# EAGLE design P1001-001-007-320 - Programmer (EAGLE 9.4.2)

## Sheet 1 of 2
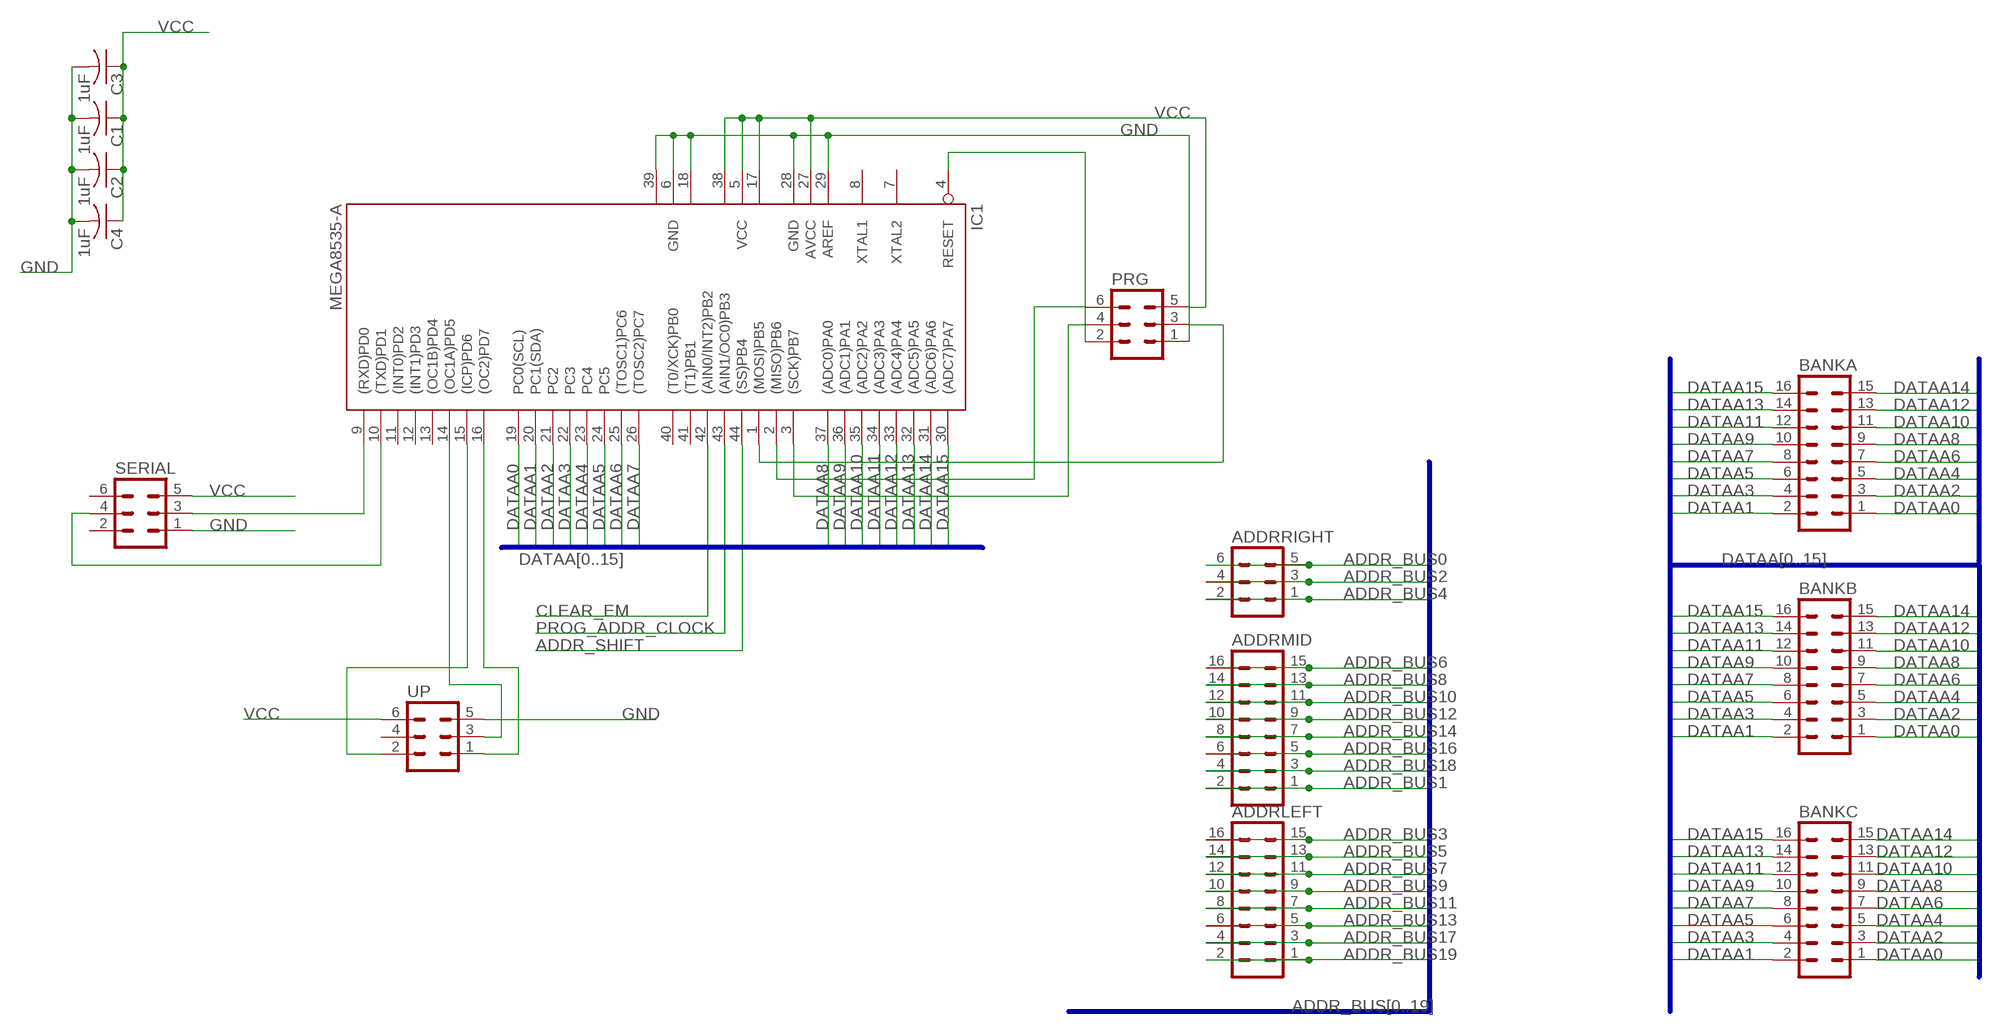
[diagram p0: schematic, sheet 1]

### Parts
ADDRLEFT  ML16  [ML16]
ADDRMID  ML16  [ML16]
ADDRRIGHT  ML6  [ML6]
BANKA  ML16  [ML16]
BANKB  ML16  [ML16]
BANKC  ML16  [ML16]
C1  1uF  C-USC1206  [C1206]
C2  1uF  C-USC1206  [C1206]
C3  1uF  C-USC1206  [C1206]
C4  1uF  C-USC1206  [C1206]
IC1  MEGA8535-A  [TQFP44]
PRG  ML6  [ML6]
SERIAL  ML6  [ML6]
UP  ML6  [ML6]

### Nets
ADDR_BUS0: ADDRRIGHT.5 ADDRRIGHT.6 ; also sheet 2
ADDR_BUS1: ADDRMID.1 ADDRMID.2 ; also sheet 2
ADDR_BUS2: ADDRRIGHT.3 ADDRRIGHT.4 ; also sheet 2
ADDR_BUS3: ADDRLEFT.15 ADDRLEFT.16 ; also sheet 2
ADDR_BUS4: ADDRRIGHT.1 ADDRRIGHT.2 ; also sheet 2
ADDR_BUS5: ADDRLEFT.13 ADDRLEFT.14 ; also sheet 2
ADDR_BUS6: ADDRMID.15 ADDRMID.16 ; also sheet 2
ADDR_BUS7: ADDRLEFT.11 ADDRLEFT.12 ; also sheet 2
ADDR_BUS8: ADDRMID.13 ADDRMID.14 ; also sheet 2
ADDR_BUS9: ADDRLEFT.9 ADDRLEFT.10 ; also sheet 2
ADDR_BUS10: ADDRMID.11 ADDRMID.12 ; also sheet 2
ADDR_BUS11: ADDRLEFT.7 ADDRLEFT.8 ; also sheet 2
ADDR_BUS12: ADDRMID.9 ADDRMID.10 ; also sheet 2
ADDR_BUS13: ADDRLEFT.5 ADDRLEFT.6 ; also sheet 2
ADDR_BUS14: ADDRMID.7 ADDRMID.8 ; also sheet 2
ADDR_BUS16: ADDRMID.5 ADDRMID.6 ; also sheet 2
ADDR_BUS17: ADDRLEFT.3 ADDRLEFT.4 ; also sheet 2
ADDR_BUS18: ADDRMID.3 ADDRMID.4 ; also sheet 2
ADDR_BUS19: ADDRLEFT.1 ADDRLEFT.2 ; also sheet 2
ADDR_SHIFT: IC1.44((SS)PB4) ; also sheet 2
CLEAR_EM: IC1.42((AIN0/INT2)PB2) ; also sheet 2
DATAA0: BANKA.1 BANKB.1 BANKC.1 IC1.19(PC0(SCL))
DATAA1: BANKA.2 BANKB.2 BANKC.2 IC1.20(PC1(SDA))
DATAA2: BANKA.3 BANKB.3 BANKC.3 IC1.21(PC2)
DATAA3: BANKA.4 BANKB.4 BANKC.4 IC1.22(PC3)
DATAA4: BANKA.5 BANKB.5 BANKC.5 IC1.23(PC4)
DATAA5: BANKA.6 BANKB.6 BANKC.6 IC1.24(PC5)
DATAA6: BANKA.7 BANKB.7 BANKC.7 IC1.25((TOSC1)PC6)
DATAA7: BANKA.8 BANKB.8 BANKC.8 IC1.26((TOSC2)PC7)
DATAA8: BANKA.9 BANKB.9 BANKC.9 IC1.37((ADC0)PA0)
DATAA9: BANKA.10 BANKB.10 BANKC.10 IC1.36((ADC1)PA1)
DATAA10: BANKA.11 BANKB.11 BANKC.11 IC1.35((ADC2)PA2)
DATAA11: BANKA.12 BANKB.12 BANKC.12 IC1.34((ADC3)PA3)
DATAA12: BANKA.13 BANKB.13 BANKC.13 IC1.33((ADC4)PA4)
DATAA13: BANKA.14 BANKB.14 BANKC.14 IC1.32((ADC5)PA5)
DATAA14: BANKA.15 BANKB.15 BANKC.15 IC1.31((ADC6)PA6)
DATAA15: BANKA.16 BANKB.16 BANKC.16 IC1.30((ADC7)PA7)
GND [power]: C1.2 C2.2 C3.2 C4.2 IC1.6(GND) IC1.18(GND1) IC1.28(GND) IC1.29(AREF) IC1.39(GND2) PRG.1 SERIAL.1 UP.5
N$1: IC1.14((OC1A)PD5) UP.3
N$2: IC1.1((MOSI)PB5) PRG.3
N$3: IC1.3((SCK)PB7) PRG.4
N$4: IC1.2((MISO)PB6) PRG.6
N$5: IC1.4(RESET) PRG.2
N$6: IC1.16((OC2)PD7) UP.1
N$7: IC1.9((RXD)PD0) SERIAL.3
N$8: IC1.10((TXD)PD1) SERIAL.4
N$9: IC1.15((ICP)PD6) UP.2
PROG_ADDR_CLOCK: IC1.43((AIN1/OC0)PB3) ; also sheet 2
VCC [power]: C1.1 C2.1 C3.1 C4.1 IC1.5(VCC) IC1.17(VCC1) IC1.27(AVCC) IC1.38(VCC2) PRG.5 SERIAL.5 UP.6 ; also sheet 2
Unconnected: IC1.7(XTAL2) IC1.8(XTAL1) IC1.11((INT0)PD2) IC1.12((INT1)PD3) IC1.13((OC1B)PD4) IC1.40((T0/XCK)PB0) IC1.41((T1)PB1) SERIAL.2 SERIAL.6 UP.4

### Buses
ADDR_BUS[0..19]
DATAA[0..15]

## Sheet 2 of 2
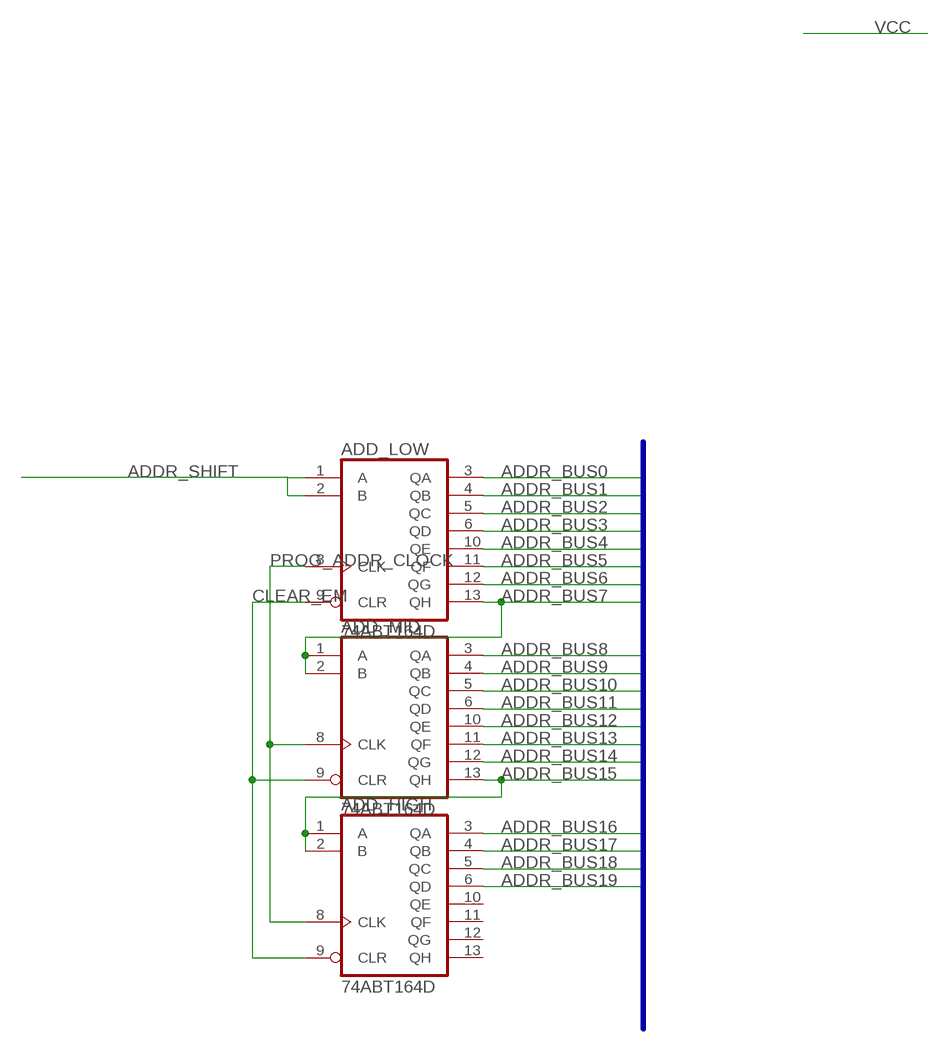
[diagram p1: schematic, sheet 2]

### Parts
ADD_HIGH  74ABT164D  [SO14]
ADD_LOW  74ABT164D  [SO14]
ADD_MID  74ABT164D  [SO14]

### Nets
ADDR_BUS0: ADD_LOW.3(QA) ; also sheet 1
ADDR_BUS1: ADD_LOW.4(QB) ; also sheet 1
ADDR_BUS2: ADD_LOW.5(QC) ; also sheet 1
ADDR_BUS3: ADD_LOW.6(QD) ; also sheet 1
ADDR_BUS4: ADD_LOW.10(QE) ; also sheet 1
ADDR_BUS5: ADD_LOW.11(QF) ; also sheet 1
ADDR_BUS6: ADD_LOW.12(QG) ; also sheet 1
ADDR_BUS7: ADD_LOW.13(QH) ADD_MID.1(A) ADD_MID.2(B) ; also sheet 1
ADDR_BUS8: ADD_MID.3(QA) ; also sheet 1
ADDR_BUS9: ADD_MID.4(QB) ; also sheet 1
ADDR_BUS10: ADD_MID.5(QC) ; also sheet 1
ADDR_BUS11: ADD_MID.6(QD) ; also sheet 1
ADDR_BUS12: ADD_MID.10(QE) ; also sheet 1
ADDR_BUS13: ADD_MID.11(QF) ; also sheet 1
ADDR_BUS14: ADD_MID.12(QG) ; also sheet 1
ADDR_BUS15: ADD_HIGH.1(A) ADD_HIGH.2(B) ADD_MID.13(QH)
ADDR_BUS16: ADD_HIGH.3(QA) ; also sheet 1
ADDR_BUS17: ADD_HIGH.4(QB) ; also sheet 1
ADDR_BUS18: ADD_HIGH.5(QC) ; also sheet 1
ADDR_BUS19: ADD_HIGH.6(QD) ; also sheet 1
ADDR_SHIFT: ADD_LOW.1(A) ADD_LOW.2(B) ; also sheet 1
CLEAR_EM: ADD_HIGH.9(CLR) ADD_LOW.9(CLR) ADD_MID.9(CLR) ; also sheet 1
PROG_ADDR_CLOCK: ADD_HIGH.8(CLK) ADD_LOW.8(CLK) ADD_MID.8(CLK) ; also sheet 1
Unconnected: ADD_HIGH.10(QE) ADD_HIGH.11(QF) ADD_HIGH.12(QG) ADD_HIGH.13(QH)

### Buses
ADDR_BUS[0..19]

## Power pins joined to a net without a drawn wire
GND: ADD_HIGH.7(GND) ADD_LOW.7(GND) ADD_MID.7(GND)
VCC: ADD_HIGH.14(VCC) ADD_LOW.14(VCC) ADD_MID.14(VCC)

## Library data of the parts
ADD_HIGH ADD_LOW ADD_MID = 74xx-us:74*164: 8-bit parallel out SHIFT REGISTER
ADDRLEFT ADDRMID BANKA BANKB BANKC = con-harting-ml:ML16: HARTING; OC_FARNELL: unknown; OC_NEWARK: unknown
ADDRRIGHT PRG SERIAL UP = con-harting-ml:ML6: HARTING; OC_FARNELL: unknown; OC_NEWARK: unknown
C1-C4 = rcl:C-US: CAPACITOR, American symbol; SPICEPREFIX: C
IC1 = atmel:MEGA8535: MICROCONTROLLER 8 Kbytes FLASH 512 bytes SRAM 512 bytes EEPROM USART 8-channel 10 bit ADC Source: avr.lbr; MPN: ATMEGA8535-16AU; OC_FARNELL: 1528437; OC_NEWARK: 01M6908

## Net classes
1 power: width 0.457 mm

## Board
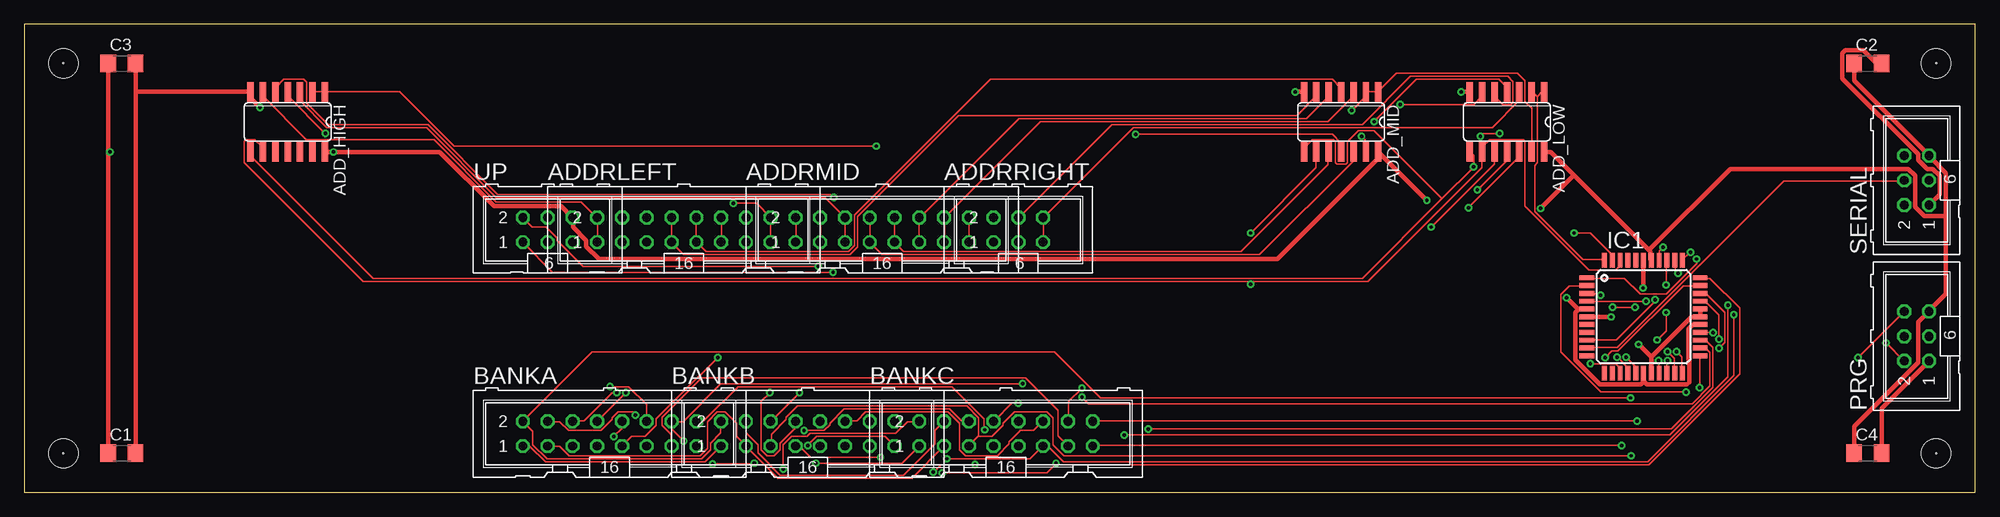
[diagram p2: board, top side]
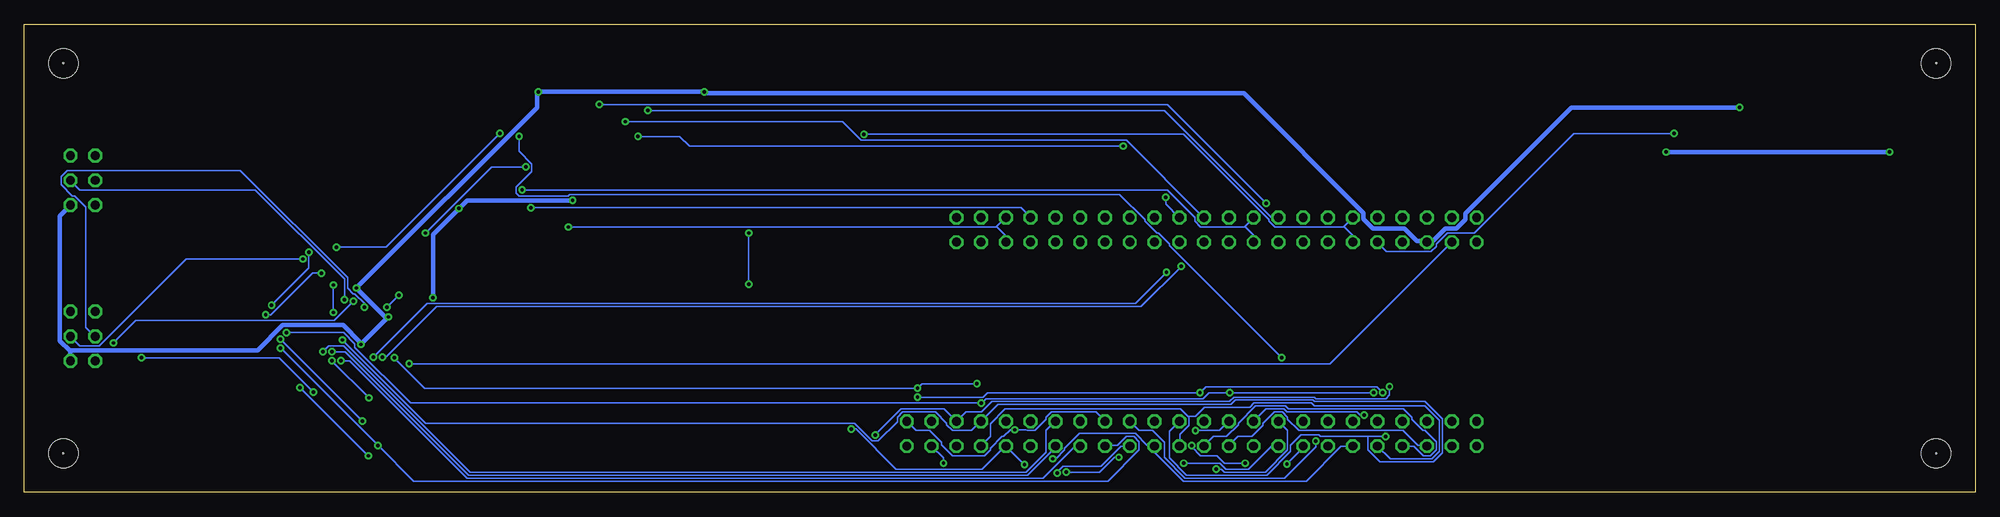
[diagram p3: board, bottom side, seen from below]

Size 200 x 48 mm. Coordinates in mm from the lower left corner, seen from the top.
Outline: 0,0 200,0 200,48 0,48 0,0
Copper layers (1*16): Top 0.035mm / dielectric 1.5mm / Bottom 0.035mm
Design rules "default *": minimum track width 6mil, minimum drill 0.35mm, track to track 6mil, track to pad 6mil, pad to pad 6mil, via to via 6mil, smd to smd 6mil, copper to edge 40mil, drill to drill 6mil, minimum pad ring 10mil, minimum via ring 8mil, stop-mask expansion 4mil, vias tented up to drill 0mil, thermal gap 10mil
Holes 0.12 mm at 4,4 196,44 4,44 196,4
Holes 3 mm at 4,44 4,4 196,4 196,44

### Footprints (pad centres in the part's own frame; a part is rotated, then mirrored left to right if it is on the bottom)
SO14 = smd 0.66 x 2.032: 1 -3.81,-3.073; 2 -2.54,-3.073; 3 -1.27,-3.073; 4 0,-3.073; 5 1.27,-3.073; 6 2.54,-3.073; 7 3.81,-3.073; 8 3.81,3.073; 9 2.54,3.073; 10 1.27,3.073; 11 0,3.073; 12 -1.27,3.073; 13 -2.54,3.073; 14 -3.81,3.073
ML16 = drill 0.914 octagon: 1 -8.89,-1.27; 2 -8.89,1.27; 3 -6.35,-1.27; 4 -6.35,1.27; 5 -3.81,-1.27; 6 -3.81,1.27; 7 -1.27,-1.27; 8 -1.27,1.27; 9 1.27,-1.27; 10 1.27,1.27; 11 3.81,-1.27; 12 3.81,1.27; 13 6.35,-1.27; 14 6.35,1.27; 15 8.89,-1.27; 16 8.89,1.27
ML6 = drill 0.914 octagon: 1 -2.54,-1.27; 2 -2.54,1.27; 3 0,-1.27; 4 0,1.27; 5 2.54,-1.27; 6 2.54,1.27
C1206 = smd 1.6 x 1.8: 1 -1.4,0; 2 1.4,0
TQFP44 = smd 1.5 x 0.5: 1 -5.8,4; 2 -5.8,3.2; 3 -5.8,2.4; 4 -5.8,1.6; 5 -5.8,0.8; 6 -5.8,0; 7 -5.8,-0.8; 8 -5.8,-1.6; 9 -5.8,-2.4; 10 -5.8,-3.2; 11 -5.8,-4; 23 5.8,-4; 24 5.8,-3.2; 25 5.8,-2.4; 26 5.8,-1.6; 27 5.8,-0.8; 28 5.8,0; 29 5.8,0.8; 30 5.8,1.6; 31 5.8,2.4; 32 5.8,3.2; 33 5.8,4 | smd 0.5 x 1.5: 12 -4,-5.8; 13 -3.2,-5.8; 14 -2.4,-5.8; 15 -1.6,-5.8; 16 -0.8,-5.8; 17 0,-5.8; 18 0.8,-5.8; 19 1.6,-5.8; 20 2.4,-5.8; 21 3.2,-5.8; 22 4,-5.8; 34 4,5.8; 35 3.2,5.8; 36 2.4,5.8; 37 1.6,5.8; 38 0.8,5.8; 39 0,5.8; 40 -0.8,5.8; 41 -1.6,5.8; 42 -2.4,5.8; 43 -3.2,5.8; 44 -4,5.8

### Placement (x,y rotation side)
ADD_HIGH  27,38 180 top
ADD_LOW  152,38 180 top
ADD_MID  135,38 180 top
ADDRLEFT  67.62,26.92 0 top
ADDRMID  87.94,26.92 0 top
ADDRRIGHT  101.91,26.92 0 top
BANKA  60,6 0 top
BANKB  80.32,6 0 top
BANKC  100.64,6 0 top
C1  10,4 0 top
C2  189,44 0 top
C3  10,44 0 top
C4  189,4 0 top
IC1  166,18 0 top
PRG  194,16 90 top
SERIAL  194,32 90 top
UP  53.65,26.92 0 top

### Tracks (layer width: path | path; a pad name or v marks a point on that pad's centre or on a via)
ADDR_BUS0
  Top 0.152: ADD_LOW.3 153.24,41.07 153.24,40.16 150.5,37.41 113.69,37.41 104.47,28.19 ADDRRIGHT.6 104.47,28.12 104.47,25.68 ADDRRIGHT.5
ADDR_BUS1  (via drill 0.35)
  Top 0.152: v138.38,38.02 142.72,42.37 151.18,42.37 151.94,41.6 151.94,41.15 ADD_LOW.4 | ADDRMID.1 79.1,25.68 79.1,28.12 ADDRMID.2
  Bottom 0.152: v138.38,38.02 116.13,38.02 114.22,36.12 87.02,36.12 79.1,28.19 ADDRMID.2
ADDR_BUS2
  Top 0.152: ADD_LOW.5 150.8,41.07 150.8,40.54 151.56,39.78 152.4,39.78 152.63,40.01 152.63,42.14 152.09,42.67 142.11,42.67 137.16,37.72 111.48,37.72 101.96,28.19 ADDRRIGHT.4 101.96,28.12 101.96,25.68 ADDRRIGHT.3
ADDR_BUS3  (via drill 0.35)
  Top 0.152: v141.05,39.78 148.59,39.78 149.43,40.62 149.43,41.07 ADD_LOW.6 | v72.69,29.64 75.06,29.64 ADDRLEFT.16 76.5,28.12 76.5,25.68 ADDRLEFT.15
  Bottom 0.152: v141.05,39.78 82.83,39.78 v72.69,29.64
ADDR_BUS4  (via drill 0.35)
  Top 0.152: v144.25,27.2 150.72,33.68 150.72,34.9 ADD_LOW.10
  Bottom 0.152: v144.25,27.2 100.36,27.2 100.32,27.24 | 100.32,27.24 99.44,28.12 ADDRRIGHT.2 | 100.32,27.24 99.44,26.36 99.44,25.68 ADDRRIGHT.1
ADDR_BUS5  (via drill 0.35)
  Top 0.152: v148.97,31.01 151.94,33.98 151.94,34.9 ADD_LOW.11
  Bottom 0.152: v148.97,31.01 82.83,31.01 80.01,28.19 80.01,27.81 79.4,27.2 74.91,27.2 74.87,27.24 | 74.87,27.24 73.99,28.12 ADDRLEFT.14 | 74.87,27.24 73.99,26.36 73.99,25.68 ADDRLEFT.13
ADDR_BUS6  (via drill 0.35)
  Top 0.152: v148.06,29.18 153.24,34.37 153.24,34.9 ADD_LOW.12 | ADDRMID.15 96.85,25.68 96.85,28.12 ADDRMID.16
  Bottom 0.152: v148.06,29.18 97.84,29.18 96.85,28.19 ADDRMID.16
ADDR_BUS7  (via drill 0.35)
  Top 0.152: ADDRLEFT.11 71.48,25.68 71.48,28.12 ADDRLEFT.12 | ADD_LOW.13 154.53,34.98 154.53,39.4 153.85,40.08 153.85,42.22 153.09,42.98 140.66,42.98 138.84,41.15 ADD_MID.1 138.76,41.07 ADD_MID.2 137.54,41 137.54,40.62 v136.09,39.17
  Bottom 0.152: v136.09,39.17 83.13,39.17 72.16,28.19 71.48,28.19 ADDRLEFT.12
ADDR_BUS8
  Top 0.152: ADD_MID.3 136.25,41.07 136.25,40.62 133.66,38.02 104.17,38.02 94.34,28.19 ADDRMID.14 94.34,28.12 94.34,25.68 ADDRMID.13
ADDR_BUS9
  Top 0.152: ADD_MID.4 134.95,41.15 134.95,41.53 134.11,42.37 99.06,42.37 85.11,28.42 85.11,25.3 84.51,24.69 69.88,24.69 68.96,25.6 ADDRLEFT.9 68.89,25.68 68.89,28.12 ADDRLEFT.10
ADDR_BUS10
  Top 0.152: ADD_MID.5 133.66,41.07 133.66,40.54 131.44,38.33 101.96,38.33 91.82,28.19 ADDRMID.12 91.75,28.12 91.75,25.68 ADDRMID.11
ADDR_BUS11
  Top 0.152: ADD_MID.6 132.44,41.07 132.44,40.62 130.45,38.63 95.78,38.63 85.42,28.27 85.42,25.15 84.66,24.38 67.59,24.38 66.37,25.6 ADDRLEFT.7 66.37,25.68 66.37,28.12 ADDRLEFT.8
ADDR_BUS12
  Top 0.152: ADD_MID.10 133.66,34.9 133.66,33.6 124.74,24.69 90.14,24.69 89.23,25.6 ADDRMID.9 89.23,25.68 89.23,28.12 ADDRMID.10
ADDR_BUS13  (via drill 0.35)
  Top 0.152: v113.92,36.73 134.11,36.73 134.95,35.89 134.95,34.98 ADD_MID.11
  Bottom 0.152: v113.92,36.73 81.15,36.73 72.39,27.96 72.39,27.81 71.78,27.2 64.77,27.2 64.73,27.24 | 64.73,27.24 63.86,28.12 ADDRLEFT.6 | 64.73,27.24 63.86,26.36 63.86,25.68 ADDRLEFT.5
ADDR_BUS14
  Top 0.152: ADD_MID.12 136.25,34.9 136.25,33.98 126.64,24.38 87.94,24.38 86.72,25.6 ADDRMID.7 86.72,25.68 86.72,28.12 ADDRMID.8
ADDR_BUS15  (via drill 0.35)
  Top 0.152: ADD_HIGH.2 29.57,41.07 30.79,41.07 ADD_HIGH.1 30.86,41.07 38.48,41.07 44.04,35.51 v87.33,35.51 | v137.08,36.5 137.47,36.12 137.47,34.98 ADD_MID.13
  Bottom 0.152: v137.08,36.5 132.82,36.5 131.83,35.51 v87.33,35.51
ADDR_BUS16
  Top 0.152: ADD_HIGH.3 28.27,40.16 31.01,37.41 41.22,37.41 48.39,30.25 82.07,30.25 ADDRMID.6 84.12,28.12 84.12,25.68 ADDRMID.5
ADDR_BUS17  (via drill 0.35)
  Top 0.152: v30.86,36.8 27.05,40.62 27.05,41.07 ADD_HIGH.4 | ADDRLEFT.4 61.27,28.12 61.27,25.68 ADDRLEFT.3
  Bottom 0.152: v30.86,36.8 41.15,36.8 51.36,26.59 54.1,26.59 55.24,25.45 55.24,25.22 55.78,24.69 60.35,24.69 61.27,25.6 ADDRLEFT.3
ADDR_BUS18  (via drill 0.35)
  Top 0.152: v82.98,30.25 82.68,30.56 48.54,30.56 41.38,37.72 31.17,37.72 28.96,39.93 28.96,42.06 28.65,42.37 26.59,42.37 25.76,41.53 25.76,41.15 ADD_HIGH.5 | ADDRMID.3 81.61,25.68 81.61,28.12 ADDRMID.4
  Bottom 0.152: v82.98,30.25 82.98,29.57 81.61,28.19 ADDRMID.4
ADDR_BUS19
  Top 0.152: ADD_HIGH.6 24.46,40.62 28.88,36.2 41.99,36.2 48.39,29.79 57.07,29.79 58.67,28.19 ADDRLEFT.2 58.75,28.12 58.75,25.68 ADDRLEFT.1
ADDR_SHIFT
  Top 0.152: 155.1,40.58 154.61,41.07 ADD_LOW.2 | 155.1,40.58 155.14,40.54 155.14,33.83 154.84,33.53 154.84,28.8 159.79,23.85 161.93,23.85 IC1.44 | 155.1,40.58 155.6,41.07 155.75,41.07 ADD_LOW.1
CLEAR_EM  (via drill 0.35)
  Top 0.152: IC1.42 163.53,23.77 163.53,23.16 163.14,22.78 160.4,22.78 153.85,29.34 153.85,36.04 153.69,36.2 150.27,36.2 149.5,35.43 149.5,34.98 ADD_LOW.9 149.43,34.9 149.43,33.3 137.77,21.64 125.73,21.64 | 125.73,21.64 34.75,21.64 22.55,33.83 22.55,35.97 22.78,36.2 23.62,36.2 24.38,35.43 24.38,34.98 ADD_HIGH.9 | v125.73,26.59 132.44,33.3 132.44,34.9 ADD_MID.9 | 125.73,21.64 v125.73,21.34
  Bottom 0.152: v125.73,21.34 v125.73,26.59
DATAA0  (via drill 0.35)
  Top 0.152: BANKA.1 51.13,4.72 51.82,4.72 53.42,3.12 69.8,3.12 71.4,4.72 BANKB.1 | v167.56,13.49 167.56,12.27 IC1.19 | v81.15,2.97 89.99,2.97 BANKC.1
  Bottom 0.152: v167.56,13.49 166.65,13.49 154.61,1.45 95.56,1.45 92.28,4.72 91.82,4.72 BANKC.1 | v81.15,2.97 77.42,2.97 76.81,2.36 74.52,2.36 72.16,4.72 71.48,4.72 BANKB.1
DATAA1  (via drill 0.35)
  Top 0.152: v168.48,13.49 168.4,13.41 168.4,12.27 IC1.20 | v164.67,9.68 110.34,9.68 105.61,14.4 58.22,14.4 51.13,7.32 BANKA.2 51.13,7.24 52.12,6.25 52.12,4.88 53.57,3.43 69.42,3.43 70.33,4.34 70.33,5.03 71.4,6.1 71.4,7.24 BANKB.2 | v77.8,2.36 77.8,4.88 78.64,5.71 80.24,5.71 80.54,6.02 89.31,6.02 90.53,7.24 91.75,7.24 BANKC.2
  Bottom 0.152: v164.67,9.68 v168.48,13.49 | v77.8,2.36 77.27,2.36 76.96,2.06 72.77,2.06 70.48,4.34 70.48,6.33 71.4,7.24 BANKB.2
DATAA2  (via drill 0.35)
  Top 0.152: BANKA.3 53.72,4.72 54.86,4.72 55.85,3.73 69.27,3.73 70.03,4.5 70.03,7.24 71.02,8.23 71.86,8.23 73,7.09 73,5.71 73.91,4.8 BANKB.3 73.99,4.72 77.27,1.45 90.98,1.45 94.26,4.72 BANKC.3 | v168.48,14.4 169.16,13.72 169.16,12.27 IC1.21
  Bottom 0.152: v168.48,14.4 167.11,14.4 154.46,1.75 97.16,1.75 94.34,4.57 94.34,4.72 BANKC.3
DATAA3  (via drill 0.35)
  Top 0.152: v62.64,7.92 62.33,8.23 60.88,8.23 60.27,7.62 60.27,7.47 59.13,6.33 55.78,6.33 54.86,7.24 53.72,7.24 BANKA.4 | v169.39,14.4 169.93,13.87 169.93,12.27 IC1.22 | BANKB.4 73.99,7.24 73.99,6.1 75.21,4.88 75.21,4.04 77.5,1.75 90.14,1.75 93.34,4.95 93.34,6.33 94.26,7.24 BANKC.4
  Bottom 0.152: v62.64,7.92 63.09,7.92 63.4,8.23 70.56,8.23 70.87,8.53 72.69,8.53 73.91,7.32 BANKB.4 | v169.39,14.4 168.78,15.01 167.26,15.01 154.31,2.06 97.31,2.06 95.25,4.12 95.25,6.33 94.34,7.24 BANKC.4
DATAA4  (via drill 0.35)
  Top 0.152: v171.75,10.74 171.75,13.95 IC1.23 | v164.74,3.73 106.6,3.73 105.46,4.88 105.46,7.62 104.85,8.23 101.5,8.23 100.36,7.09 100.36,6.86 99.21,5.71 97.84,5.71 | 97.84,5.71 97.77,5.71 96.85,4.8 BANKC.5 | 97.84,5.71 97.84,7.62 96.62,8.84 79.25,8.84 78.11,7.7 78.11,7.47 76.58,5.94 76.58,4.8 BANKB.5
  Bottom 0.152: BANKA.5 56.24,4.8 57.15,4.8 58.67,6.33 69.34,6.33 70.48,7.47 70.48,7.7 71.02,8.23 71.86,8.23 73,7.09 73,6.86 74.14,5.71 75.59,5.71 76.5,4.8 BANKB.5 | v164.74,3.73 v171.75,10.74
DATAA5  (via drill 0.35)
  Top 0.152: v108.43,9.75 109.12,9.07 170.99,9.07 172.82,10.9 172.82,14.33 172.36,14.78 171.83,14.78 IC1.24 | v79.48,10.21 76.58,7.32 BANKB.6 | v60.73,10.21 60.27,10.21 57.38,7.32 56.24,7.32 BANKA.6 | v79.93,6.33 81.99,6.33 82.6,6.93 82.6,7.09 84.05,8.53 94.87,8.53 96.09,7.32 96.77,7.32 BANKC.6
  Bottom 0.152: v108.43,9.75 101.73,9.75 101.27,10.21 v79.48,10.21 78.87,10.82 61.34,10.82 v60.73,10.21 | v79.93,6.33 77.5,6.33 76.58,7.24 BANKB.6
DATAA6  (via drill 0.35)
  Top 0.152: v115.21,6.48 168.86,6.48 173.13,10.74 173.13,14.86 172.44,15.54 171.83,15.54 IC1.25 | v87.78,3.58 80.62,3.58 79.48,4.72 79.1,4.72 BANKB.7 | v93.19,2.06 93.95,2.82 v97.46,2.82
  Bottom 0.152: BANKA.7 58.67,4.72 57.53,4.72 56.54,3.73 55.85,3.73 55.24,4.34 55.24,5.18 56.39,6.33 56.62,6.33 57.76,7.47 57.76,7.7 58.6,8.53 70.41,8.53 70.71,8.84 73.76,8.84 75.51,7.09 75.51,6.93 76.73,5.71 78.11,5.71 79.02,4.8 BANKB.7 | v115.21,6.48 114.76,6.48 110.64,2.36 101.8,2.36 99.44,4.72 BANKC.7 v97.46,2.82 | v87.78,3.58 88.24,3.58 89.76,2.06 v93.19,2.06
DATAA7  (via drill 0.35)
  Top 0.152: v173.13,16.38 171.83,16.38 IC1.26 | v101.88,9.14 101.27,9.14 99.44,7.32 BANKC.8 | v61.65,10.21 58.75,7.32 BANKA.8 | v76.43,10.21 75.51,9.3 75.51,4.34 76.12,3.73 76.89,3.73 77.5,4.34 77.5,5.03 79.02,6.55 79.02,7.24 BANKB.8
  Bottom 0.152: v173.13,16.38 167.26,16.38 166.12,15.24 166.12,14.86 160.4,9.14 v101.88,9.14 101.42,9.6 79.17,9.6 78.56,10.21 v76.43,10.21 v61.65,10.21
DATAA8  (via drill 0.35)
  Top 0.152: v168.02,25.15 167.64,24.77 167.64,23.85 IC1.37 | v151.26,36.8 149.58,36.8 v149.28,36.5 | v71.09,13.79 69.34,12.04 69.27,12.04 64.77,7.54 64.77,6.86 63.63,5.71 62.26,5.71 61.34,4.8 BANKA.9
  Bottom 0.152: 80.66,7.73 81.46,8.53 99.44,8.53 100.97,7.01 100.97,5.71 101.88,4.8 BANKC.9 | 80.66,7.73 80.62,7.7 80.62,6.86 81.53,5.94 81.53,4.8 BANKB.9 | v168.02,25.15 162.92,25.15 v151.26,36.8 | v149.28,36.5 149.28,34.98 147.98,33.68 147.98,32.92 149.58,31.32 149.58,30.71 149.28,30.4 144.25,30.4 144.09,30.56 87.71,30.56 85.11,27.96 85.11,27.81 83.9,26.59 83.74,26.59 82.6,25.45 82.6,25.3 v71.09,13.79 | 80.66,7.73 80.62,7.77 79.93,7.77 79.02,8.69 74.37,8.69 73.91,9.14 68.05,9.14 67.74,8.84 56.39,8.84 54.94,7.39 54.94,4.19 55.7,3.43 59.97,3.43 BANKA.9
DATAA9  (via drill 0.35)
  Top 0.152: v60.43,5.71 61.27,6.55 61.27,7.24 BANKA.10 | v168.33,21.26 168.33,23.77 IC1.36 | v168.33,18.44 168.33,16.54 v167.41,15.62
  Bottom 0.152: 62.26,5.71 67.13,5.71 67.28,5.87 69.11,5.87 70.18,4.8 70.18,4.19 72.62,1.75 80.85,1.75 82.6,3.5 82.6,6.25 81.61,7.24 BANKB.10 | 62.26,5.71 v60.43,5.71 | v168.33,18.44 v168.33,21.26 | v167.41,15.62 158.88,7.09 114.91,7.09 113.08,5.26 112.47,5.26 110.49,7.24 110.49,7.7 109.96,8.23 106.6,8.23 105.46,7.09 105.46,6.93 104.85,6.33 102.87,6.33 101.96,7.24 BANKC.10 101.88,7.32 100.2,8.99 76.28,8.99 75.82,9.45 67.89,9.45 67.74,9.3 56.39,9.3 54.63,7.54 54.63,4.04 55.55,3.12 61.04,3.12 62.26,4.34 62.26,5.71
DATAA10  (via drill 0.35)
  Top 0.152: v169.54,22.48 169.24,22.78 169.24,23.77 IC1.35 | v175.26,18.21 175.26,11.96 166.42,3.12 106.53,3.12 104.93,4.72 104.47,4.72 BANKC.11 104.39,4.72 103.1,3.43 v94.56,3.43
  Bottom 0.152: BANKA.11 63.86,4.72 65,4.72 68.58,1.14 81.15,1.14 84.12,4.12 BANKB.11 84.2,4.8 84.89,4.8 86.11,6.02 91.82,6.02 93.34,4.5 93.34,4.34 94.26,3.43 v94.56,3.43 | v169.54,22.48 170.46,22.48 174.73,18.21 v175.26,18.21
DATAA11  (via drill 0.35)
  Top 0.152: v170.84,24.61 170.76,24.61 170,23.85 IC1.34 | v174.65,19.2 174.65,11.81 168.71,5.87 v112.78,5.87 | v60.05,10.82 61.95,10.82 63.78,8.99 63.78,7.32 BANKA.12 | BANKB.12 84.2,7.32 85.34,7.32 86.26,8.23 94.72,8.23 95.86,7.09 95.86,4.34 96.47,3.73 99.75,3.73 100.97,4.95 100.97,5.18 102.11,6.33 103.48,6.33 104.39,7.24 BANKC.12
  Bottom 0.152: v170.84,24.61 170.84,23.01 v174.65,19.2 | v112.78,5.87 110.11,8.53 105.69,8.53 104.47,7.32 BANKC.12 104.39,7.32 103.48,8.23 101.88,8.23 100.81,9.3 76.43,9.3 75.97,9.75 67.74,9.75 67.59,9.6 60.43,9.6 60.05,9.98 v60.05,10.82
DATAA12  (via drill 0.35)
  Top 0.152: IC1.33 171.83,21.95 172.82,21.95 175.87,18.9 175.87,12.12 166.57,2.82 105.92,2.82 v105.77,2.97 105.77,2.9 104.85,1.98 v94.11,1.98 | BANKA.13 66.29,4.8 66.29,5.94 65.38,6.86 65.38,7.7 69.42,11.73 102.64,11.73 105.99,8.38 105.99,5.79 106.98,4.8 BANKC.13
  Bottom 0.152: v105.77,2.97 105.77,3.5 BANKC.13 | v94.11,1.98 94.11,2.06 93.5,2.67 89.61,2.67 87.55,4.72 86.72,4.72 BANKB.13
DATAA13  (via drill 0.35)
  Top 0.152: v67.59,5.26 66.37,6.48 66.37,7.24 BANKA.14 66.45,7.24 67.51,7.24 71.4,11.12 v102.34,11.12 | v162.08,13.79 162.76,14.48 163.37,14.48 170.08,21.18 171.75,21.18 IC1.32 | v108.43,10.67 107.06,9.3 107.06,7.32 BANKC.14
  Bottom 0.152: v67.59,5.26 67.59,4.65 70.79,1.45 81,1.45 83.13,3.58 83.13,5.11 84.35,6.33 85.72,6.33 86.64,7.24 BANKB.14 | v162.08,13.79 158.95,10.67 v108.43,10.67 107.97,11.12 v102.34,11.12
DATAA14  (via drill 0.35)
  Top 0.152: v70.56,2.9 74.75,2.9 v74.83,2.97 | v80.31,4.8 81.23,5.71 88.24,5.71 89.15,4.8 BANKB.15 | v173.74,14.78 174.35,15.39 174.35,18.44 172.44,20.34 171.83,20.34 IC1.31 | v163.75,4.8 109.58,4.8 BANKC.15
  Bottom 0.152: v70.56,2.9 68.96,4.5 68.96,4.72 BANKA.15 | v74.83,2.97 76.96,2.97 77.72,3.73 79.4,3.73 80.31,4.65 v80.31,4.8 | v173.74,14.78 v163.75,4.8 160.1,1.14 88.92,1.14 85.72,4.34 85.72,5.18 86.26,5.71 87.02,5.71 87.94,4.8 89.15,4.8 BANKB.15
DATAA15  (via drill 0.35)
  Top 0.152: v98.45,6.4 98.37,6.48 98.37,7.54 95.1,10.82 73.15,10.82 69.65,7.32 68.96,7.32 BANKA.16 | v173.74,15.7 173.74,18.21 172.36,19.58 171.83,19.58 IC1.30 | v165.35,7.32 109.58,7.32 BANKC.16
  Bottom 0.152: BANKB.16 89.23,7.32 90.14,8.23 94.72,8.23 95.25,7.7 95.25,7.47 96.39,6.33 97.23,6.33 97.31,6.4 v98.45,6.4 98.91,6.4 99.59,5.71 99.75,5.71 100.97,4.5 100.97,4.34 101.58,3.73 104.85,3.73 105.99,4.88 105.99,5.11 107.21,6.33 108.58,6.33 109.5,7.24 BANKC.16 | v165.35,7.32 v173.74,15.7
GND  (via drill 0.35)
  Top 0.457: 11.43,41.07 11.43,43.97 C3.2 | 11.43,41.07 11.43,4.04 C1.2 | 11.43,41.07 23.16,41.07 ADD_HIGH.7 23.16,40.84 23.16,40.46 v24.16,39.47 | C4.2 190.42,4.04 190.42,8.61 195.22,13.41 PRG.1 | C2.2 190.35,44.04 189.81,44.04 188.52,45.34 186.69,45.34 186.38,45.03 186.38,42.44 194.16,34.67 194.16,34.06 195.07,33.15 195.68,33.15 196.37,32.46 196.37,30.56 195.3,29.49 SERIAL.1 | v130.3,41.07 131.14,41.07 ADD_MID.7 | v147.29,41.07 148.13,41.07 ADD_LOW.7 | 166.8,13.87 166.8,12.27 IC1.18 | 166.8,13.87 170.92,17.98 171.75,17.98 IC1.28 171.83,18.21 171.83,18.75 IC1.29 | v162.69,17.98 160.25,17.98 IC1.6 | 166.8,13.87 v165.51,15.16 | v165.96,20.95 165.96,23.77 IC1.39
  Bottom 0.457: v24.16,39.47 41.38,39.47 52.27,28.57 52.27,27.96 53.19,27.05 54.33,27.05 55.7,25.68 56.16,25.68 UP.5 56.39,25.76 57.23,25.76 58.52,27.05 61.72,27.05 62.71,28.04 62.71,28.65 74.98,40.92 130.15,40.92 v130.3,41.07 v147.29,41.07 147.45,40.92 147.45,39.47 v165.96,20.95 162.99,17.98 v162.69,17.98 v165.51,15.16 165.58,15.39 167.34,17.14 173.51,17.14 176.1,14.55 195.15,14.55 195.3,14.48 | 195.3,14.48 195.3,13.49 PRG.1 | 195.3,14.48 196.37,15.54 196.37,28.35 195.3,29.41 SERIAL.1
N$1  (via drill 0.35)
  Top 0.152: v160.55,13.18 163.14,13.18 163.53,12.8 163.53,12.27 IC1.14
  Bottom 0.152: v160.55,13.18 66.14,13.18 53.72,25.6 UP.3
N$2  (via drill 0.35)
  Top 0.152: v171.45,23.93 171.45,23.47 168.33,20.34 165.66,20.34 164.06,21.95 160.25,21.95 IC1.1
  Bottom 0.152: v171.45,23.93 183.41,23.93 192.33,15.01 194.31,15.01 195.22,15.93 PRG.3
N$3  (via drill 0.35)
  Top 0.152: v161.62,20.19 161.47,20.34 160.25,20.34 IC1.3 | v165.12,18.97 v162.84,18.97
  Bottom 0.152: v162.84,18.97 v161.62,20.19 | v165.12,18.97 165.12,19.36 166.12,20.34 166.27,20.34 166.88,20.95 166.88,22.02 177.85,32.99 195.6,32.99 196.22,32.38 196.22,31.55 195.07,30.4 194.84,30.4 193.7,29.26 193.7,16.92 192.79,16 PRG.4
N$4  (via drill 0.35)
  Top 0.152: v170.38,10.29 161.62,10.29 157.5,14.4 157.5,20.27 158.42,21.18 160.17,21.18 IC1.2 | v187.99,13.79 192.71,18.52 PRG.6
  Bottom 0.152: v170.38,10.29 173.89,13.79 v187.99,13.79
N$5  (via drill 0.35)
  Top 0.152: v166.27,19.58 160.25,19.58 IC1.4 | v190.88,15.32 192.71,13.49 PRG.2
  Bottom 0.152: v166.27,19.58 168.25,17.6 188.59,17.6 v190.88,15.32
N$6  (via drill 0.35)
  Top 0.152: v164.21,13.87 165.12,12.95 165.12,12.27 IC1.16 | v82.91,22.55 54.18,22.55 51.13,25.6 UP.1
  Bottom 0.152: v164.21,13.87 158.72,19.36 86.11,19.36 v82.91,22.55
N$7  (via drill 0.35)
  Top 0.152: v167.18,19.74 167.18,19.58 163.22,15.62 160.25,15.62 IC1.9
  Bottom 0.152: v167.18,19.74 167.18,21.87 176.33,31.01 194.31,31.01 195.22,31.93 SERIAL.3
N$8
  Top 0.152: IC1.10 160.25,14.86 163.3,14.86 180.37,31.93 192.71,31.93 SERIAL.4
N$9  (via drill 0.35)
  Top 0.152: v163.3,13.87 164.36,12.8 164.36,12.27 IC1.15 | v81.38,23.16 57.3,23.16 54.63,25.83 54.63,26.06 53.49,27.2 52.05,27.2 51.13,28.12 UP.2
  Bottom 0.152: v163.3,13.87 162.92,13.87 157.73,19.05 85.5,19.05 v81.38,23.16
PROG_ADDR_CLOCK  (via drill 0.35)
  Top 0.152: v158.88,26.59 160.55,26.59 162.76,24.38 162.76,23.85 IC1.43 | ADD_LOW.8 148.21,34.9 148.59,34.52 v148.59,33.38 145.35,30.14 | 145.35,30.14 137.16,21.95 35.74,21.95 23.24,34.44 23.24,34.9 ADD_HIGH.8 | 145.35,30.14 138.38,37.11 136.78,37.11 135.64,35.97 135.64,33.83 135.48,33.68 134.57,33.68 134.42,33.83 134.42,35.97 134.19,36.2 132.06,36.2 131.22,35.36 131.22,34.98 ADD_MID.8
  Bottom 0.152: v158.88,26.59 152.09,33.38 v148.59,33.38
VCC  (via drill 0.35)
  Top 0.457: ADD_HIGH.14 30.86,34.9 v31.7,34.9 42.6,34.9 48.16,29.34 55.02,29.34 56.16,28.19 UP.6 56.24,27.96 56.24,27.2 57.61,25.83 57.61,25.22 58.9,23.93 128.47,23.93 138.99,34.44 ADD_MID.14 138.84,34.9 v143.79,29.95 | 8.61,34.9 8.61,43.97 C3.1 | 8.61,34.9 8.61,4.04 C1.1 | v8.76,34.9 8.61,34.9 | C2.1 187.6,43.97 187.6,42.22 195.22,34.59 SERIAL.5 195.38,34.37 196.98,32.77 196.98,28.35 | C4.1 187.6,4.04 187.6,6.78 194.16,13.34 194.16,17.45 195.22,18.52 PRG.5 195.38,18.75 196.98,20.34 196.98,28.35 | 166.04,11.35 166.04,12.19 IC1.17 | 166.04,11.35 166.34,11.05 170.46,11.05 170.69,11.28 170.69,13.56 170.61,13.64 170.61,16.76 170.99,17.14 171.75,17.14 IC1.27 | 159.33,18.75 160.17,18.75 IC1.5 | 159.33,18.75 159.03,18.44 159.03,13.56 161.54,11.05 165.74,11.05 166.04,11.35 | 158.88,32.54 156.51,34.9 155.83,34.9 ADD_LOW.14 | 158.88,32.54 166.57,24.84 | 166.57,24.84 166.73,24.69 166.73,23.85 IC1.38 | 158.88,32.54 v155.45,29.11 | v158.12,19.96 159.33,18.75 | 196.98,28.35 194.77,28.35 193.85,29.26 193.85,32.46 193.17,33.15 174.88,33.15 166.57,24.84
  Bottom 0.457: v8.76,34.9 v31.7,34.9 | v143.79,29.95 154.61,29.95 v155.45,29.11 158.12,26.44 v158.12,19.96